# Altium schematic sheet Schematic.SchDoc
size A
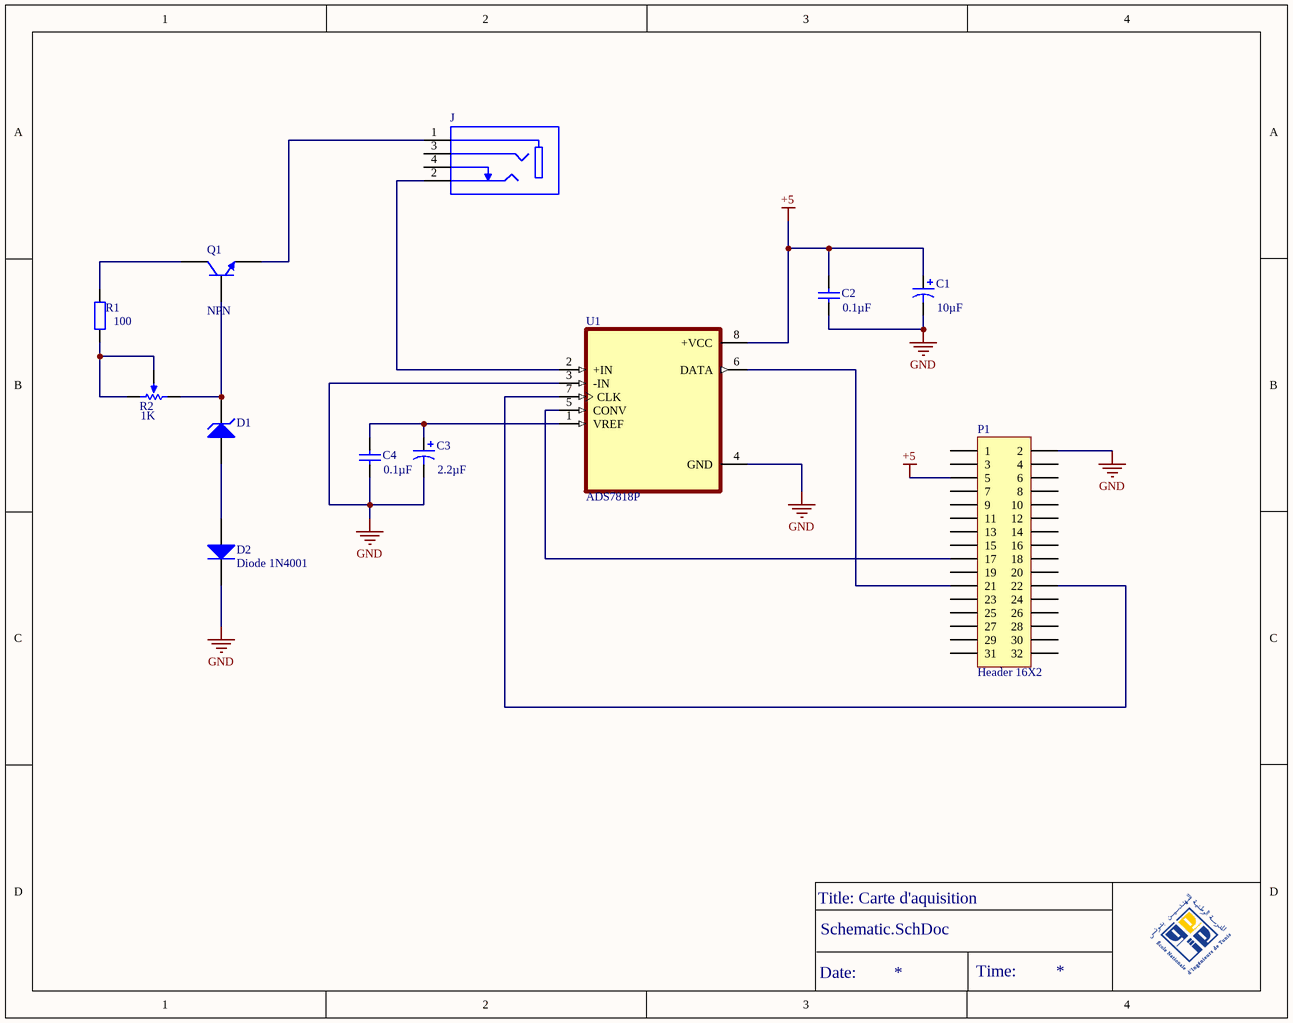
[diagram p0: Schematic.SchDoc]

## Parts
C1  value 10µF  [RB7.6-15]  (hidden comment: Cap Pol1)
C2  value 0.1µF  [RAD-0.3]  (hidden comment: Cap)
C3  value 2.2µF  [RB7.6-15]  (hidden comment: Cap Pol1)
C4  value 0.1µF  [RAD-0.3]  (hidden comment: Cap)
D1  D Zener  [DIODE-0.7]  (value not drawn)
D2  Diode 1N4001  [DO-41]
J  SJ1-3534N  [CUI_SJ1-3534N]  (value not drawn)
P1  Header 16X2  [HDR2X16]
Q1  NPN  [TO-226-AA]
R1  value 100  [AXIAL-0.4]  (hidden comment: Res2)
R2  value 1K  [VR5]  (hidden comment: RPot)
U1  ADS7818P  [DIP794W45P254L959H508Q8]

## Nets
+5: C1.1 C2.2 P1.5 U1.8(+VCC)
GND: C1.2 C2.1 C3.2 C4.1 D2.2(K) P1.2 U1.3(-IN) U1.4(GND)
NetC3_1: C3.1 C4.2 U1.1(VREF)
NetD1_1: D1.1(A) D2.1(A)
NetD1_2: D1.2(K) Q1.2(B) R2.1(TOP)
NetJ_1: J.1 Q1.3(E)
NetJ_2: J.2 U1.2(+IN)
NetP1_17: P1.17 U1.5(CONV)
NetP1_21: P1.21 U1.6(DATA)
NetP1_22: P1.22 U1.7(CLK)
NetQ1_1: Q1.1(C) R1.2
NetR1_1: R1.1 R2.2(BOT) R2.3(TAP)

Not connected (* = marked no-connect by the designer): J 3 4; P1 1 3 4 6 7 8 9 10 11 12 13 14 15 16 18 19 20 23 24 25 26 27 28 29 30 31 32

## Notes on the sheet
- Title: Carte d'aquisition
- Date:
- Time:

## Library data of the parts
C1 C3 = Cap Pol1: Polarized Capacitor (Radial); Published: 8-Jun-2000; LatestRevisionDate: 17-Jul-2002; LatestRevisionNote: Re-released for DXP Platform.; PackageReference: RB7.6-15; Publisher: Altium Limited; PackageDescription: Polarized Capacitor (Radial); 2 Leads
C2 C4 = Cap: Capacitor; Published: 8-Jun-2000; LatestRevisionDate: 17-Jul-2002; LatestRevisionNote: Re-released for DXP Platform.; PackageReference: RAD-0.3; Publisher: Altium Limited; PackageDescription: Radial Cap, Thru-Hole; 2 Leads; 0.3 in Pin Spacing
D1 = D Zener: Zener Diode; Published: 8-Jun-2000; LatestRevisionDate: 17-Jul-2002; LatestRevisionNote: Re-released for DXP Platform.; PackageReference: DIODE-0.7; Publisher: Altium Limited; PackageDescription: Diode, Thru-Hole; 2 Leads; 0.7 in Pin Spacing
D2 = Diode 1N4001: 1 Amp General Purpose Rectifier; Published: 8-Jun-2000; LatestRevisionDate: 17-Jul-2002; LatestRevisionNote: Re-released for DXP Platform.; DatasheetVersion: 1998; PackageVersion: Aug-1999; PackageReference: DO-41; Publisher: Altium Limited; PackageDescription: Diode, Axial; Body 5.2 x 2.7 mm (LxDia. max), Lead Dia. 0.86 mm (max); Code_JEDEC: DO-204-AL; ComponentLink1Description: Manufacturer Link; ComponentLink1URL: http://www.fairchildsemi.com/; ComponentLink2Description: Datasheet; ComponentLink2URL: http://www.fairchildsemi.com/ds/1N%2F1N4001.pdf
J = SJ1-3534N: 3,5 Ð¼Ð¼, ÑÑ‚ÐµÑ€ÐµÐ¾, Ð¿Ñ€ÑÐ¼Ð¾Ð¹ ÑƒÐ³Ð¾Ð», ÑÐºÐ²Ð¾Ð·Ð½Ð¾Ðµ Ð¾Ñ‚Ð²ÐµÑ€ÑÑ‚Ð¸Ðµ, Ð°ÑƒÐ´Ð¸Ð¾Ñ€Ð°Ð·ÑŠÐµÐ¼; MF: CUI Devices; SnapEDA_Link: https://www.snapeda.com/parts/SJ1-3534N/CUI%20Devices/view-part/576149/?ref=snap; Availability: Unavailable; Value: *; Price: None; MP: SJ1-3534N; Package: None; CUI_purchase_URL: https://www.cuidevices.com/product/interconnect/connectors/audio-connectors/jacks/sj1-353xn-series?utm_source=snapeda.com&utm_medium=referral&utm_campaign=snapedaBOM
P1 = Header 16X2: Header, 16-Pin, Dual row; LatestRevisionDate: 17-Jul-2002; LatestRevisionNote: Re-released for DXP Platform.; Publisher: Altium Limited
Q1 = NPN: NPN Bipolar Transistor; Published: 8-Jun-2000; LatestRevisionDate: 17-Jul-2002; LatestRevisionNote: Re-released for DXP Platform.; PackageReference: TO-226-AA; Publisher: Altium Limited; PackageDescription: TO, Flat Index; 3 In-Line, Axial Leads; Body Dia. 4.8mm; Leads 0.55 x 0.51 mm (max); Code_JEDEC: TO-226-AA
R1 = Res2: Resistor; PackageReference: AXIAL-0.4; PackageDescription: Axial Device, Thru-Hole; 2 Leads; 0.4 in Pin Spacing
R2 = RPot: Potentiometer; PackageReference: VR5; PackageDescription: Variable Resistor, Thru-Hole; 3 Leads
U1 = ADS7818P: Package: None; Price: None; Value: *; MP: ADS7818P; Availability: Unavailable